# Altium schematic sheet P02 BLOCK DIAGRAM.SchDoc
size 420 x 297 mm
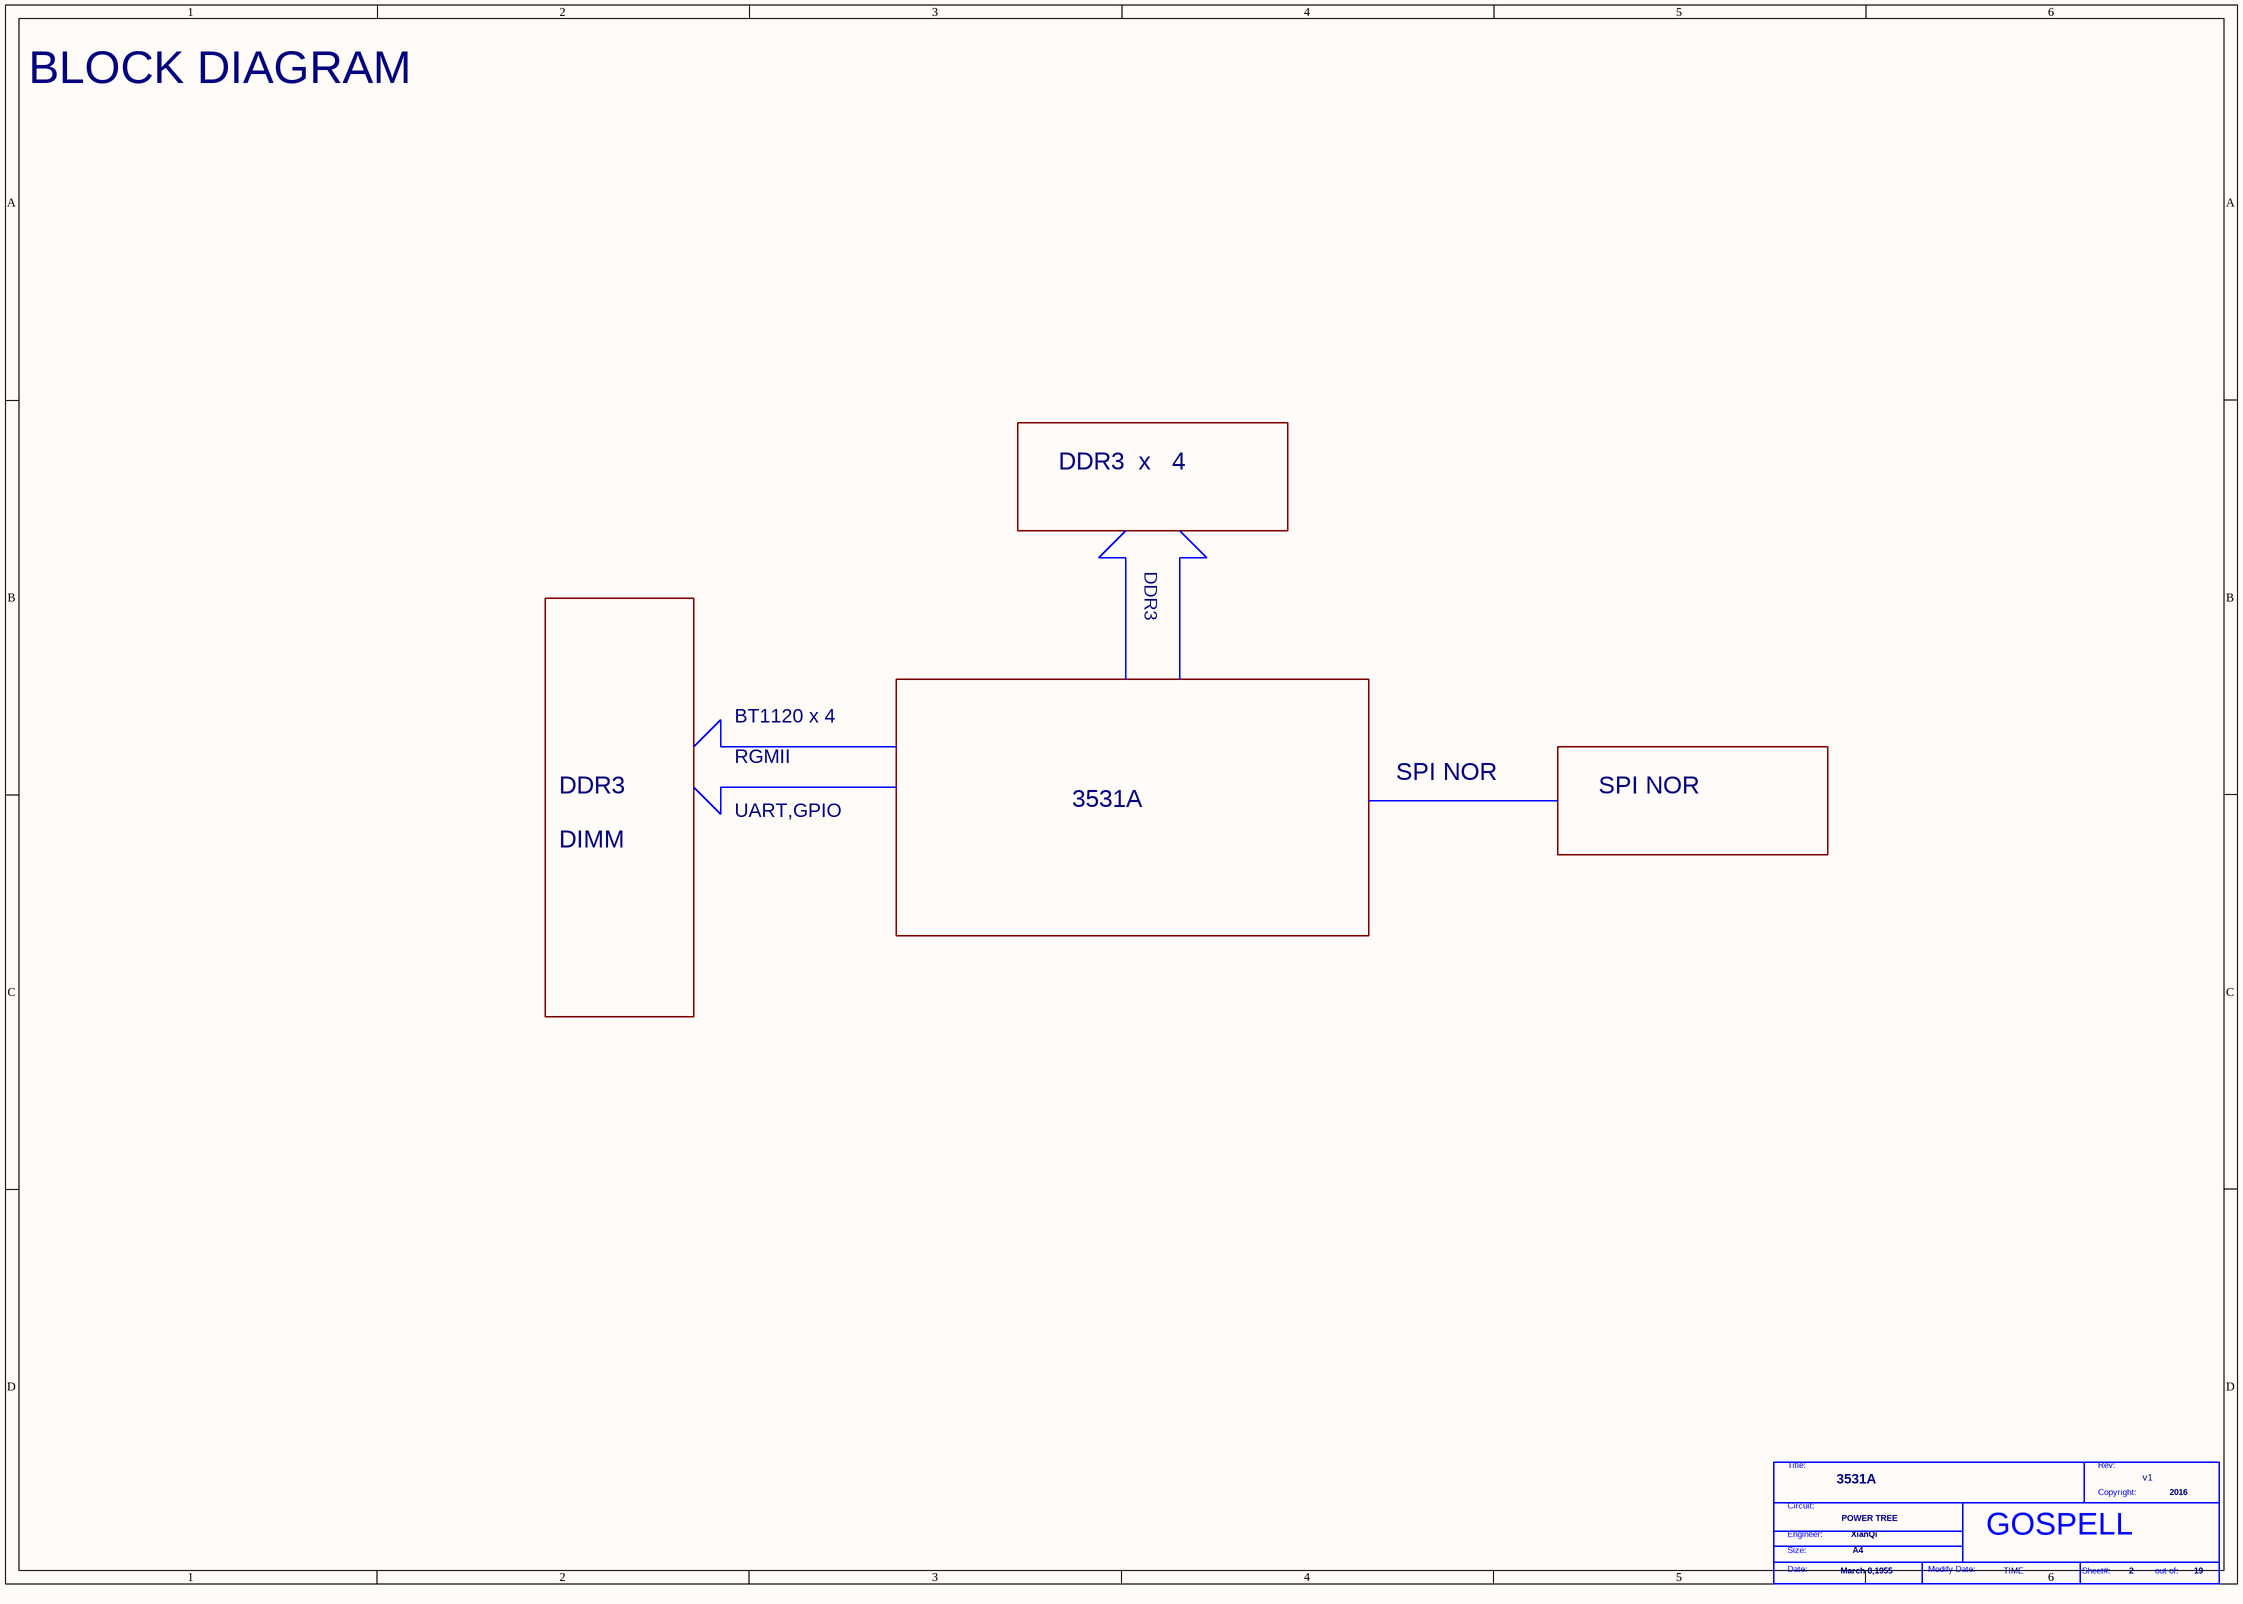
[diagram p0: P02 BLOCK DIAGRAM.SchDoc]

## Parts
*  Page Modify Date: TIME  Engineer: XianQi  Copyright: 2016  Title: 3531A  RevCode: v1  Page Size: A4  Page Create Date: March 8,1955  Page Number: 2  Page Count: 19  Doc: POWER TREE  (hidden comment: GOSPELL)  (graphical)

## Notes on the sheet
- BLOCK DIAGRAM
- DDR3  x   4
- DDR3
- BT1120 x 4
- RGMII
- SPI NOR
- DIMM
- UART,GPIO
- 3531A
- (in symbol GOSPELL) Title:; Rev:; Copyright:; Circuit:; Engineer:; Size:; Date:; Modify Date:; Sheet#:; out of: